# EAGLE design m220pal (EAGLE 4.11)
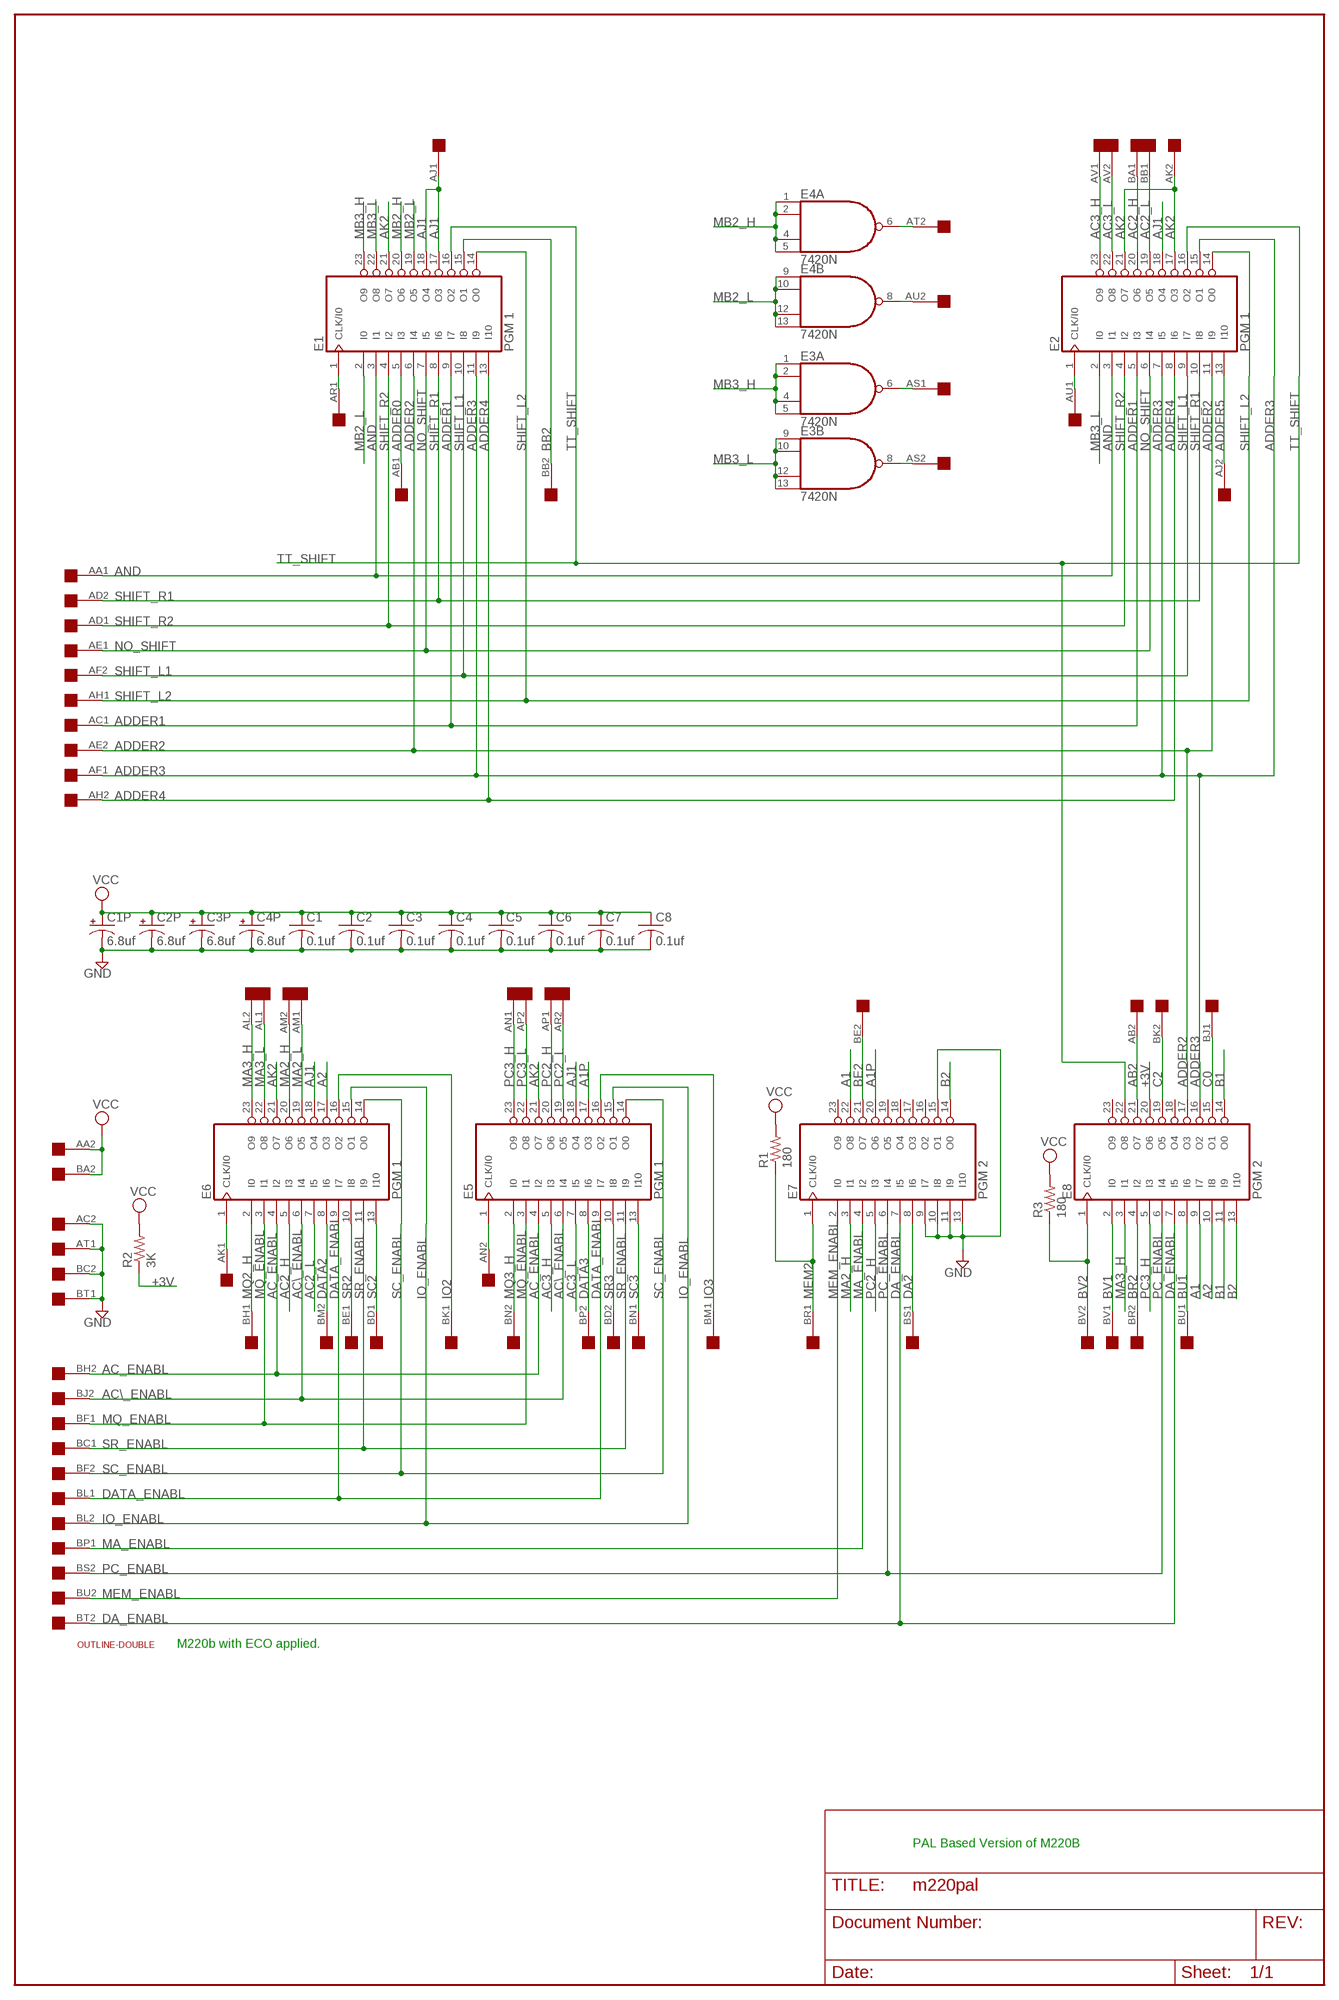
[diagram p0: schematic, sheet 1]

## Parts
C1  0.1uf  C-US050-025X075  [C050-025X075]
C1P  6.8uf  CPOL-USE15-5AXIAL  [E15-5]
C2  0.1uf  C-US050-025X075  [C050-025X075]
C2P  6.8uf  CPOL-USE15-5AXIAL  [E15-5]
C3  0.1uf  C-US050-025X075  [C050-025X075]
C3P  6.8uf  CPOL-USE15-5AXIAL  [E15-5]
C4  0.1uf  C-US050-025X075  [C050-025X075]
C4P  6.8uf  CPOL-USE15-5AXIAL  [E15-5]
C5  0.1uf  C-US050-025X075  [C050-025X075]
C6  0.1uf  C-US050-025X075  [C050-025X075]
C7  0.1uf  C-US050-025X075  [C050-025X075]
C8  0.1uf  C-US050-025X075  [C050-025X075]
E1  PGM 1  22V10  [DIL24-3]
E2  PGM 1  22V10  [DIL24-3]
E3  7420N  74S20N  [DIL14]
E4  7420N  74S20N  [DIL14]
E5  PGM 1  22V10  [DIL24-3]
E6  PGM 1  22V10  [DIL24-3]
E7  PGM 2  22V10  [DIL24-3]
E8  PGM 2  22V10  [DIL24-3]
R1  180  R-US_0207/10  [0207/10]
R2  3K  R-US_0207/10  [0207/10]
R3  180  R-US_0207/10  [0207/10]
U$1  DOUBLE  [EDGE-CON4]
U$2  OUTLINE-DOUBLE  [DOUBLE]

## Nets
+3V: E8.20(O6) R2.1
A1: E7.22(O8) E8.9(I7)
A1P: E5.17(O3) E7.20(O6)
A2: E6.17(O3) E8.10(I8)
AB2: E8.21(O7) U$1.AB2
AC2_H: E2.20(O6) E6.5(I3) U$1.BA1
AC2_L: E2.19(O5) E6.7(I5) U$1.BB1
AC3_H: E2.23(O9) E5.5(I3) U$1.AV1
AC3_L: E2.22(O8) E5.7(I5) U$1.AV2
AC\_ENABL: E5.6(I4) E6.6(I4) U$1.BJ2
AC_ENABL: E5.4(I2) E6.4(I2) U$1.BH2
ADDER0: E1.5(I3) U$1.AB1
ADDER1: E1.9(I7) E2.5(I3) U$1.AC1
ADDER2: E1.6(I4) E2.11(I9) E8.17(O3) U$1.AE2
ADDER3: E1.11(I9) E2.7(I5) E2.15(O1) E8.16(O2) U$1.AF1
ADDER4: E1.13(I10) E2.8(I6) U$1.AH2
ADDER5: E2.13(I10) U$1.AJ2
AJ1: E1.17(O3) E1.18(O4) E2.18(O4) E5.18(O4) E6.18(O4) U$1.AJ1
AK2: E1.21(O7) E2.17(O3) E2.21(O7) E5.21(O7) E6.21(O7) U$1.AK2
AND: E1.3(I1) E2.3(I1) U$1.AA1
AS1: E3.6(A:O) U$1.AS1
AS2: E3.8(B:O) U$1.AS2
AT2: E4.6(A:O) U$1.AT2
AU2: E4.8(B:O) U$1.AU2
B1: E8.11(I9) E8.14(O0)
B2: E7.14(O0) E8.13(I10)
BB2: E1.15(O1) U$1.BB2
BE2: E7.21(O7) U$1.BE2
BR2: E8.4(I2) U$1.BR2
BU1: E8.8(I6) U$1.BU1
BV1: E8.2(I0) U$1.BV1
BV2: E8.1(CLK/I0) R3.1 U$1.BV2
C0: E8.15(O1) U$1.BJ1
C2: E8.19(O5) U$1.BK2
DA2: E7.8(I6) U$1.BS1
DA_ENABL: E7.7(I5) E8.7(I5) U$1.BT2
DATA2: E6.8(I6) U$1.BM2
DATA3: E5.8(I6) U$1.BP2
DATA_ENABL: E5.9(I7) E6.9(I7) U$1.BL1
GND: C1.2 C1P.- C2.2 C2P.- C3.2 C3P.- C4.2 C4P.- C5.2 C6.2 C7.2 C8.2 E7.9(I7) E7.10(I8) E7.11(I9) E7.13(I10) E7.15(O1) U$1.AC2 U$1.AT1 U$1.BC2 U$1.BT1
IO2: E6.16(O2) U$1.BK1
IO3: E5.16(O2) U$1.BM1
IO_ENABL: E5.15(O1) E6.15(O1) U$1.BL2
MA2_H: E6.20(O6) E7.3(I1) U$1.AM2
MA2_L: E6.19(O5) U$1.AM1
MA3_H: E6.23(O9) E8.3(I1) U$1.AL2
MA3_L: E6.22(O8) U$1.AL1
MA_ENABL: E7.4(I2) U$1.BP1
MB2_H: E1.20(O6) E4.1(A:I0) E4.2(A:I1) E4.4(A:I2) E4.5(A:I3)
MB2_L: E1.2(I0) E1.19(O5) E4.9(B:I0) E4.10(B:I1) E4.12(B:I2) E4.13(B:I3)
MB3_H: E1.23(O9) E3.1(A:I0) E3.2(A:I1) E3.4(A:I2) E3.5(A:I3)
MB3_L: E1.22(O8) E2.2(I0) E3.9(B:I0) E3.10(B:I1) E3.12(B:I2) E3.13(B:I3)
MEM2: E7.1(CLK/I0) R1.1 U$1.BR1
MEM_ENABL: E7.2(I0) U$1.BU2
MQ2_H: E6.2(I0) U$1.BH1
MQ3_H: E5.2(I0) U$1.BN2
MQ_ENABL: E5.3(I1) E6.3(I1) U$1.BF1
N$1: E6.1(CLK/I0) U$1.AK1
N$2: E5.1(CLK/I0) U$1.AN2
N$3: E1.1(CLK/I0) U$1.AR1
N$4: E2.1(CLK/I0) U$1.AU1
NO_SHIFT: E1.7(I5) E2.6(I4) U$1.AE1
PC2_H: E5.20(O6) E7.5(I3) U$1.AP1
PC2_L: E5.19(O5) U$1.AR2
PC3_H: E5.23(O9) E8.5(I3) U$1.AN1
PC3_L: E5.22(O8) U$1.AP2
PC_ENABL: E7.6(I4) E8.6(I4) U$1.BS2
SC2: E6.13(I10) U$1.BD1
SC3: E5.13(I10) U$1.BN1
SC_ENABL: E5.14(O0) E6.14(O0) U$1.BF2
SHIFT_L1: E1.10(I8) E2.9(I7) U$1.AF2
SHIFT_L2: E1.14(O0) E2.14(O0) U$1.AH1
SHIFT_R1: E1.8(I6) E2.10(I8) U$1.AD2
SHIFT_R2: E1.4(I2) E2.4(I2) U$1.AD1
SR2: E6.10(I8) U$1.BE1
SR3: E5.10(I8) U$1.BD2
SR_ENABL: E5.11(I9) E6.11(I9) U$1.BC1
TT_SHIFT: E1.16(O2) E2.16(O2) E8.22(O8)
VCC: C1.1 C1P.+ C2.1 C2P.+ C3.1 C3P.+ C4.1 C4P.+ C5.1 C6.1 C7.1 C8.1 R1.2 R2.2 R3.2 U$1.AA2 U$1.BA2
Unconnected: E7.16(O2) E7.17(O3) E7.18(O4) E7.19(O5) E7.23(O9) E8.18(O4) E8.23(O9)

## Notes on the sheet
- M220b with ECO applied.
- PAL Based Version of M220B

## Power pins joined to a net without a drawn wire
GND: E1.12(GND) E2.12(GND) E3.7(P:GND) E4.7(P:GND) E5.12(GND) E6.12(GND) E7.12(GND) E8.12(GND)
VCC: E1.24(VCC) E2.24(VCC) E3.14(P:VCC) E4.14(P:VCC) E5.24(VCC) E6.24(VCC) E7.24(VCC) E8.24(VCC)

## Library data of the parts
C1-C8 = rcl:C-US: CAPACITOR, American symbol
C1P C2P C3P C4P = rcl:CPOL-US: POLARIZED CAPACITOR, American symbol
E1 E2 E5-E8 = pal:22V10: PAL
E3 E4 = 74xx-jameco:74*20: Dual 4-input NAND gate
R1-R3 = rcl:R-US_: RESISTOR, American symbol
U$1 = dec-con:DOUBLE: Double-Height DEC board
U$2 = dec-con:OUTLINE-*: Board outlines for DEC boards.

## Board
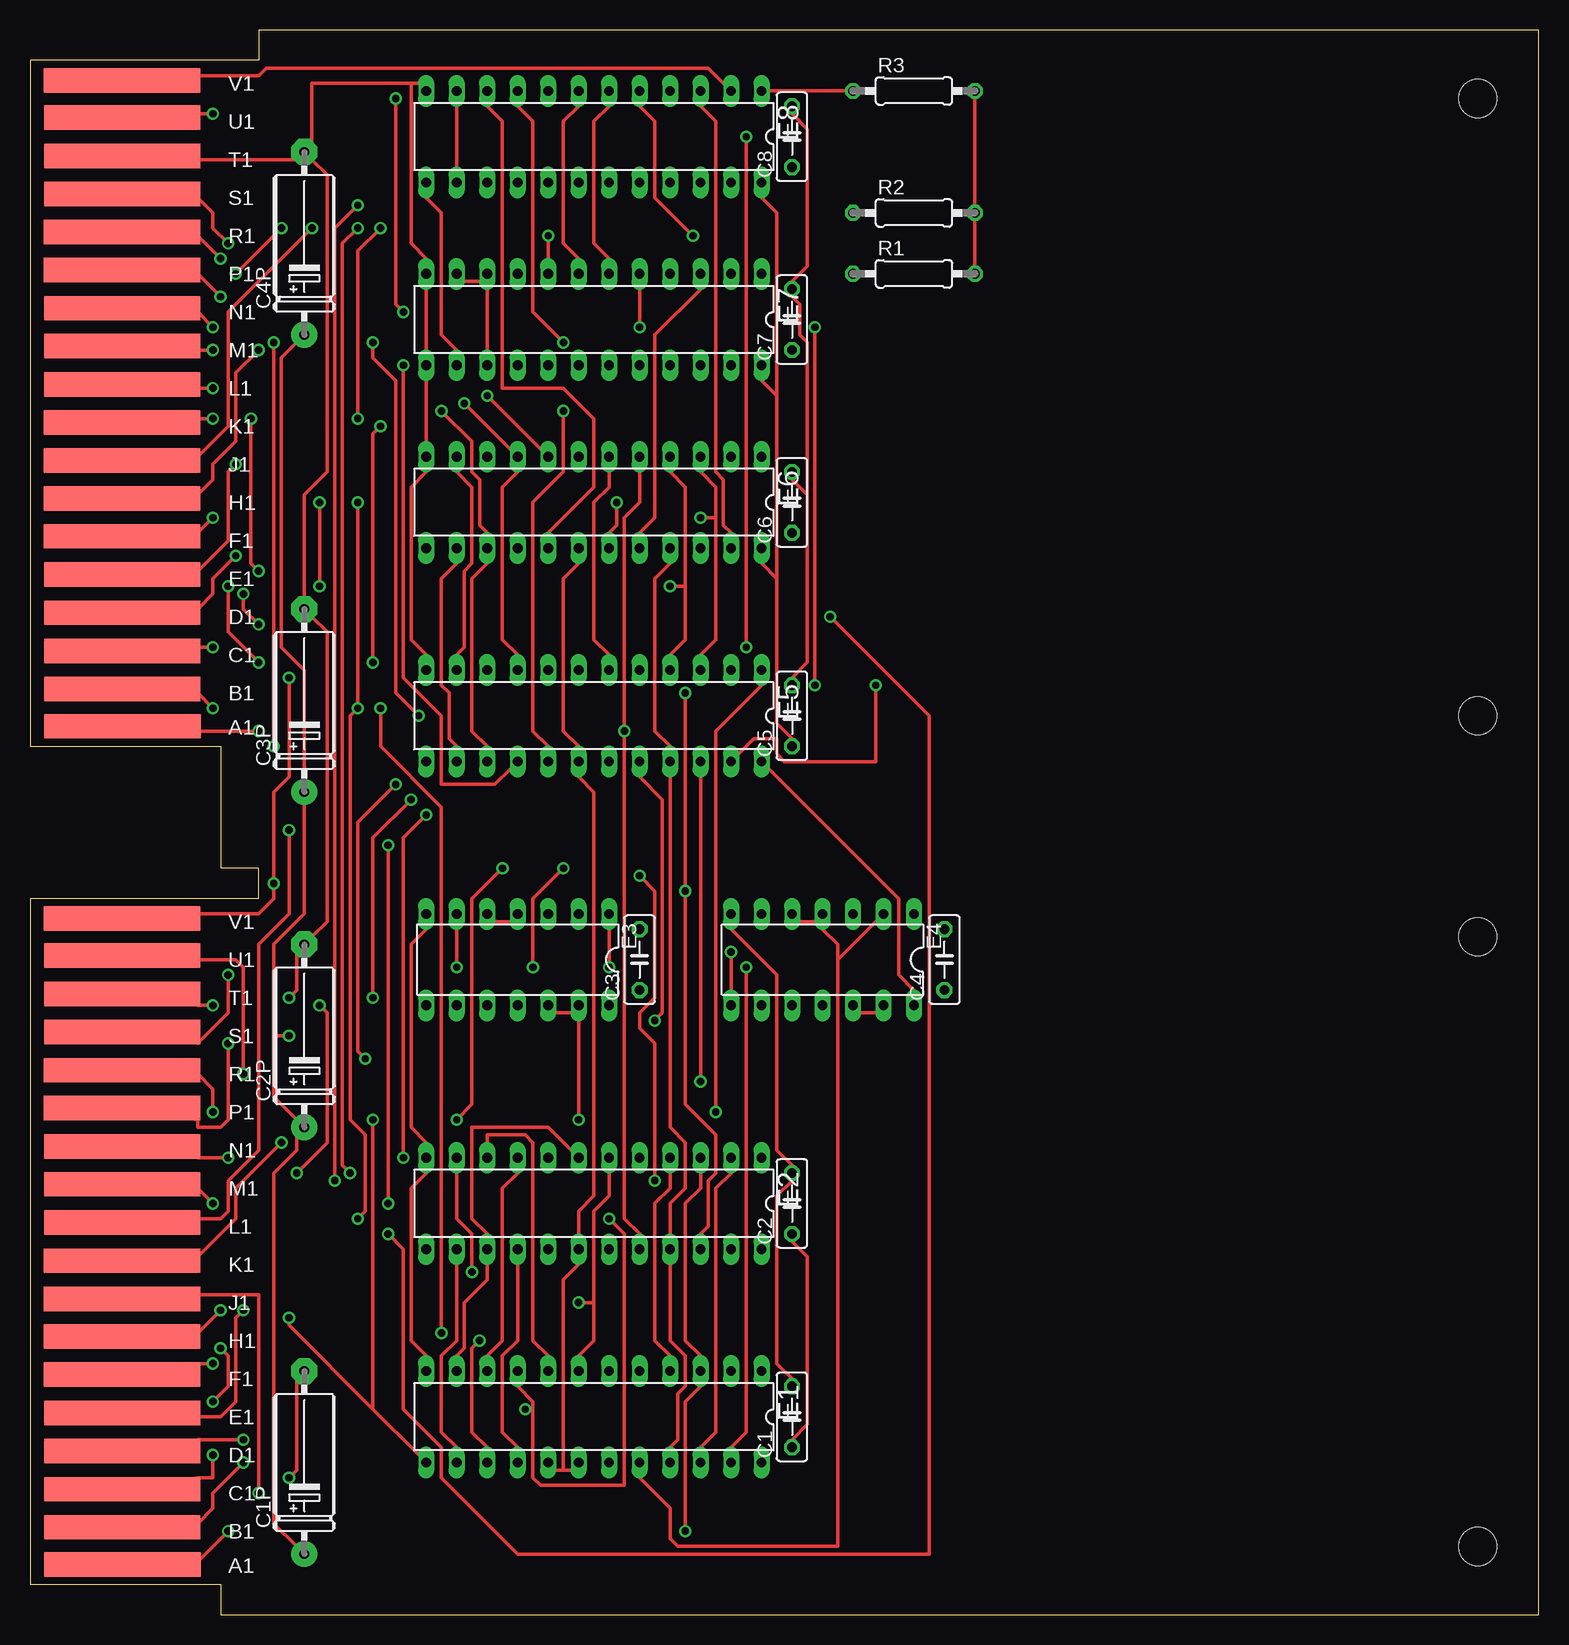
[diagram p1: board, top side]
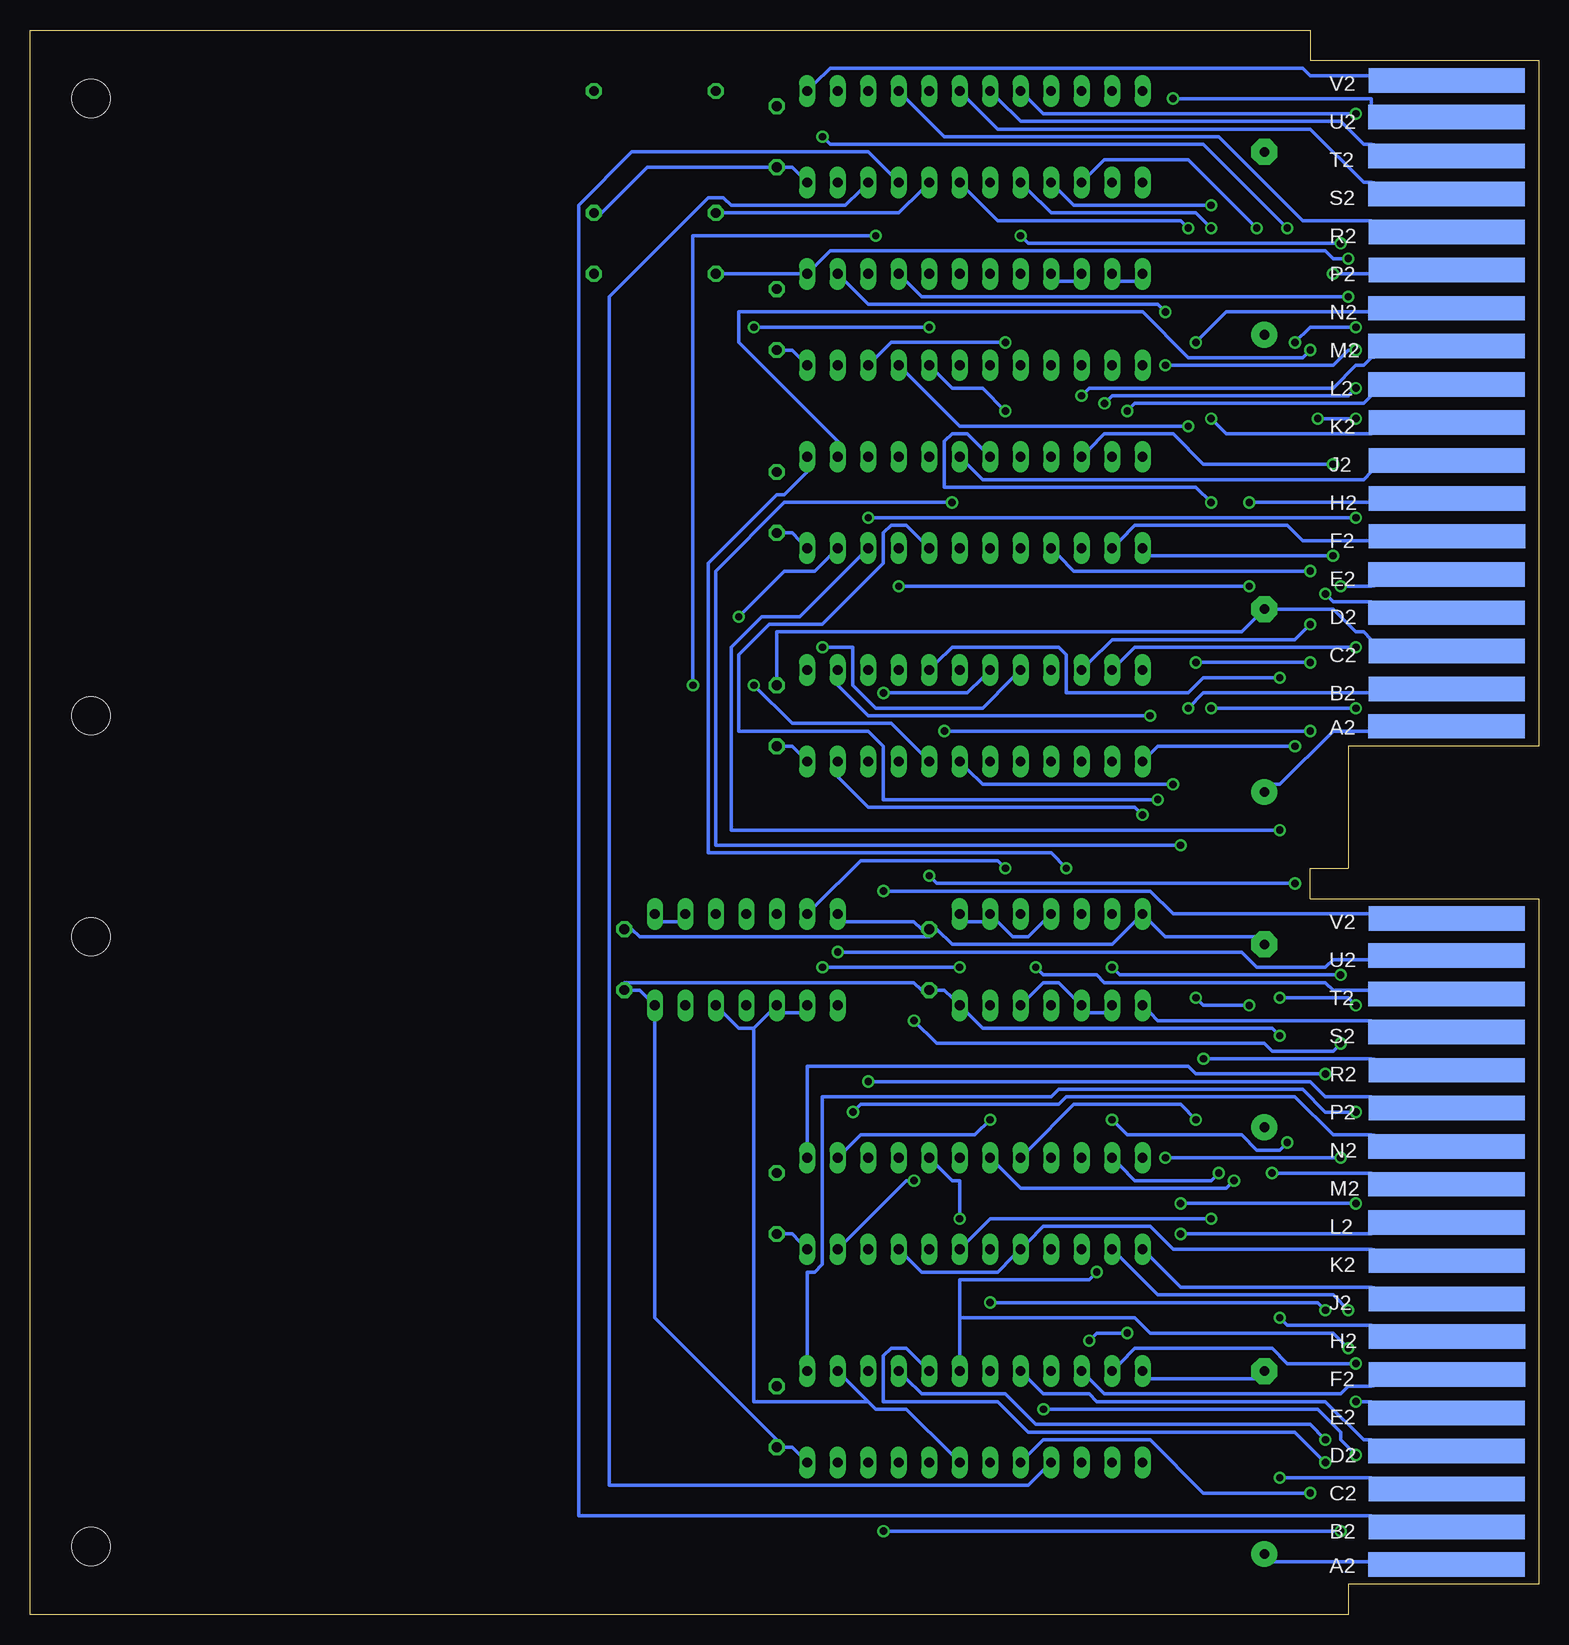
[diagram p2: board, bottom side, seen from below]

Size 125.73 x 132.08 mm. Coordinates in mm from the lower left corner, seen from the top.
Copper layers (1*16): Top 0.035mm / dielectric 1.5mm / Bottom 0.035mm
Design rules "olimex10mil": minimum track width 12mil, minimum drill 24mil, track to track 12mil, track to pad 12mil, pad to pad 12mil, via to via 12mil, smd to smd 10mil, copper to edge 25mil, drill to drill 10mil, minimum pad ring 10mil, minimum via ring 8mil, stop-mask expansion 0mil, vias tented up to drill 0mil, thermal gap 10mil

### Footprints (pad centres in the part's own frame; a part is rotated, then mirrored left to right if it is on the bottom)
C050-025X075 = drill 0.813 octagon: 1 -2.54,0; 2 2.54,0
E15-5 = drill 0.813 pad 2.159 round: + -7.62,0 | drill 0.813 pad 2.159 octagon: - 7.62,0
DIL24-3 = drill 0.813 long: 1 -13.97,-3.81; 2 -11.43,-3.81; 3 -8.89,-3.81; 4 -6.35,-3.81; 5 -3.81,-3.81; 6 -1.27,-3.81; 7 1.27,-3.81; 8 3.81,-3.81; 9 6.35,-3.81; 10 8.89,-3.81; 11 11.43,-3.81; 12 13.97,-3.81; 13 13.97,3.81; 14 11.43,3.81; 15 8.89,3.81; 16 6.35,3.81; 17 3.81,3.81; 18 1.27,3.81; 19 -1.27,3.81; 20 -3.81,3.81; 21 -6.35,3.81; 22 -8.89,3.81; 23 -11.43,3.81; 24 -13.97,3.81
DIL14 = drill 0.813 long: 1 -7.62,-3.81; 2 -5.08,-3.81; 3 -2.54,-3.81; 4 0,-3.81; 5 2.54,-3.81; 6 5.08,-3.81; 7 7.62,-3.81; 8 7.62,3.81; 9 5.08,3.81; 10 2.54,3.81; 11 0,3.81; 12 -2.54,3.81; 13 -5.08,3.81; 14 -7.62,3.81
0207/10 = drill 0.813 octagon: 1 -5.08,0; 2 5.08,0
EDGE-CON4 = smd 13.017 x 2.032: AA1 7.709,4.207; AB1 7.684,7.312; AC1 7.684,10.474; AD1 7.684,13.665; AE1 7.693,16.84; AF1 7.668,20.041; AH1 7.668,23.19; AJ1 7.668,26.34; AK1 7.668,29.515; AL1 7.693,32.69; AM1 7.693,35.89; AN1 7.693,39.04; AP1 7.668,42.24; AR1 7.668,45.39; AS1 7.693,48.565; AT1 7.693,51.74; AU1 7.693,54.94; AV1 7.668,58.026; BA1 7.709,74.057; BB1 7.684,77.162; BC1 7.684,80.324; BD1 7.684,83.515; BE1 7.693,86.69; BF1 7.668,89.891; BH1 7.668,93.04; BJ1 7.668,96.19; BK1 7.668,99.365; BL1 7.693,102.54; BM1 7.693,105.74; BN1 7.693,108.89; BP1 7.668,112.09; BR1 7.668,115.24; BS1 7.693,118.415; BT1 7.693,121.59; BU1 7.693,124.79; BV1 7.668,127.876 | smd 13.017 x 2.032 bottom: AA2 7.69,4.207; AB2 7.668,7.328; AC2 7.668,10.49; AD2 7.693,13.665; AE2 7.693,16.84; AF2 7.642,20.041; AH2 7.642,23.19; AJ2 7.668,26.34; AK2 7.668,29.515; AL2 7.693,32.69; AM2 7.693,35.89; AN2 7.693,39.04; AP2 7.668,42.24; AR2 7.668,45.39; AS2 7.693,48.565; AT2 7.693,51.74; AU2 7.693,54.966; AV2 7.668,58.026; BA2 7.69,74.057; BB2 7.668,77.178; BC2 7.668,80.34; BD2 7.693,83.515; BE2 7.693,86.69; BF2 7.642,89.891; BH2 7.642,93.04; BJ2 7.668,96.19; BK2 7.668,99.365; BL2 7.693,102.54; BM2 7.693,105.74; BN2 7.693,108.89; BP2 7.668,112.09; BR2 7.668,115.24; BS2 7.693,118.415; BT2 7.693,121.59; BU2 7.693,124.816; BV2 7.668,127.876
DOUBLE = hole 3.175: 120.65,56.515; 120.65,5.715; 120.65,74.93; 120.65,126.365

### Placement (x,y rotation side)
C1  63.5,16.51 90 top
C1P  22.86,12.7 90 top
C2  63.5,34.29 90 top
C2P  22.86,48.26 90 top
C3  50.8,54.61 90 top
C3P  22.86,76.2 90 top
C4  76.2,54.61 90 top
C4P  22.86,114.3 90 top
C5  63.5,74.93 90 top
C6  63.5,92.71 90 top
C7  63.5,107.95 90 top
C8  63.5,123.19 90 top
E1  46.99,16.51 180 top
E2  46.99,34.29 180 top
E3  40.64,54.61 180 top
E4  66.04,54.61 180 top
E5  46.99,74.93 180 top
E6  46.99,92.71 180 top
E7  46.99,107.95 180 top
E8  46.99,123.19 180 top
R1  73.66,111.76 0 top
R2  73.66,116.84 0 top
R3  73.66,127 0 top
U$1  0,0 0 top
U$2  0,0 0 top

### Tracks (layer width: path | path; a pad name or v marks a point on that pad's centre or on a via)
+3V
  Bottom 0.305: E8.20 51.44,118.75 53.34,116.84 67.95,116.84 R2.1
A1  (via drill 0.61)
  Top 0.305: v44.45,106.05 41.91,108.58 41.91,124.46 40.64,125.73 E8.9
  Bottom 0.305: v44.45,106.05 53.98,106.05 55.25,104.78 E7.22
A1P  (via drill 0.61)
  Top 0.305: v44.45,100.33 44.45,95.25 41.91,92.71 41.91,73.66 43.18,72.39 E5.17
  Bottom 0.305: v44.45,100.33 46.36,102.23 48.9,102.23 50.17,103.5 E7.20
A2
  Top 0.305: E6.17 43.18,90.17 46.99,93.98 46.99,99.69 44.45,102.23 39.37,102.23 39.37,124.46 38.1,125.73 E8.10
AB2
  Bottom 0.305: E8.21 53.98,120.02 55.88,121.92 75.57,121.92 80.01,117.47 80.01,8.26 13.97,8.26 U$1.AB2
AC2_H  (via drill 0.61)
  Top 0.305: E2.20 50.8,31.75 49.53,33.02 v49.53,73.66 49.53,91.44 50.8,92.71 50.8,95.25 E6.5 | v19.05,73.66 13.97,73.66 U$1.BA1
  Bottom 0.305: v49.53,73.66 v19.05,73.66
AC2_L  (via drill 0.61)
  Top 0.305: v27.31,92.71 v27.31,75.56 26.67,74.93 26.67,41.27 27.94,40.01 27.94,33.66 v27.31,33.02 | v15.24,75.56 13.97,76.83 U$1.BB1
  Bottom 0.305: v27.31,92.71 28.58,93.98 49.53,93.98 49.53,97.79 48.9,98.42 47.63,98.42 46.36,97.16 E6.7 | v27.31,75.56 v15.24,75.56 | v27.31,33.02 45.72,33.02 47.63,31.11 E2.19
AC3_H  (via drill 0.61)
  Top 0.305: v21.59,78.11 21.59,69.85 20.32,68.58 v20.32,60.96 20.32,59.69 19.05,58.42 13.97,58.42 U$1.AV1 | v52.07,36.2 52.07,47.62 50.8,48.9 50.8,50.16 52.07,51.44 52.07,60.33 v50.8,61.59
  Bottom 0.305: v21.59,78.11 27.94,78.11 29.21,76.83 39.37,76.83 39.37,80.01 40.01,80.64 48.9,80.64 50.17,79.38 E5.5 | v52.07,36.2 52.71,36.2 57.79,31.11 E2.23 | v50.8,61.59 50.17,60.96 v20.32,60.96
AC3_L  (via drill 0.61)
  Top 0.305: v54.61,76.83 v54.61,60.33 54.61,42.55 57.15,40.01 57.15,36.83 56.52,36.2 56.52,32.38 55.88,31.75 E2.22
  Bottom 0.305: v54.61,76.83 47.63,76.83 46.36,78.11 E5.7 | v54.61,60.33 32.39,60.33 30.48,58.42 13.97,58.42 U$1.AV2
AC\_ENABL
  Top 0.305: E5.6 48.26,80.01 46.99,81.28 46.99,92.71 48.26,93.98 48.26,95.25 E6.6
  Bottom 0.305: E6.6 47.63,95.89 46.36,94.61 14.61,94.61 13.97,95.25 U$1.BJ2
AC_ENABL  (via drill 0.61)
  Top 0.305: 54.61,85.72 54.61,93.98 53.34,95.25 E6.4 | 54.61,85.72 54.61,81.28 53.34,80.01 E5.4 | v53.34,85.72 54.61,85.72 | v24.13,92.71 v24.13,85.72
  Bottom 0.305: v24.13,85.72 v53.34,85.72 | v24.13,92.71 13.97,92.71 U$1.BH2
ADDER0  (via drill 0.61)
  Top 0.305: v17.78,12.7 15.24,10.16 15.24,8.89 13.97,7.62 U$1.AB1
  Bottom 0.305: v17.78,12.7 20.32,15.24 42.55,15.24 45.09,17.78 54.61,17.78 54.61,21.59 53.98,22.23 52.71,22.23 51.44,20.95 E1.5
ADDER1  (via drill 0.61)
  Top 0.305: 41.91,17.14 41.91,11.43 42.55,10.79 49.53,10.79 49.53,31.75 v48.26,33.02 | 41.91,17.14 41.91,17.78 40.64,19.05 E1.9 | v15.24,13.34 15.24,11.43 13.97,11.43 U$1.AC1 | v41.28,17.14 41.91,17.14
  Bottom 0.305: v48.26,33.02 48.26,36.2 48.9,36.2 50.17,37.47 E2.5 | v15.24,13.34 16.51,14.61 16.51,15.24 18.42,17.14 v41.28,17.14
ADDER2  (via drill 0.61)
  Top 0.305: v36.83,28.57 36.83,31.75 35.56,33.02 35.56,36.83 E2.11 | v27.31,115.57 26.04,114.3 26.04,37.47 v26.67,36.83 | v15.24,17.78 16.51,19.05 16.51,21.59 v15.88,22.23
  Bottom 0.305: 48.26,24.77 48.26,27.94 37.47,27.94 v36.83,28.57 | 48.26,24.77 48.26,21.59 E1.6 | v27.31,115.57 28.58,116.84 40.64,116.84 42.55,118.75 E8.17 | v26.67,36.83 27.31,36.2 33.66,36.2 34.93,37.47 E2.11 | v15.24,17.78 13.97,17.78 U$1.AE2 | v15.88,22.23 17.15,23.5 32.39,23.5 33.66,24.77 48.26,24.77
ADDER3  (via drill 0.61)
  Top 0.305: E1.11 35.56,21.59 36.2,22.23 36.2,26.04 38.1,27.94 38.1,29.21 E2.15 38.1,31.75 36.83,33.02 36.83,40.64 43.18,40.64 45.09,38.73 E2.7 | v27.31,117.47 25.4,115.57 v25.4,36.2 | v15.24,20.95 13.97,20.95 U$1.AF1
  Bottom 0.305: v27.31,117.47 38.74,117.47 40.01,118.75 E8.16 | v25.4,36.2 26.04,35.56 43.18,35.56 45.09,37.47 E2.7 | v15.24,20.95 20.96,20.95 22.23,22.23 33.66,22.23 34.93,20.95 E1.11
ADDER4  (via drill 0.61)
  Top 0.305: 28.58,17.14 21.59,24.13 v21.59,24.77 | 28.58,17.14 32.39,13.34 E1.13 | 28.58,17.14 v28.58,41.27
  Bottom 0.305: v21.59,24.77 20.96,24.13 13.97,24.13 U$1.AH2 | v28.58,41.27 29.85,42.55 38.74,42.55 42.55,38.73 E2.8
ADDER5
  Bottom 0.305: E2.13 32.39,29.84 29.85,27.3 13.97,27.3 U$1.AJ2
AJ1  (via drill 0.61)
  Top 0.305: E6.18 45.72,87.63 44.45,86.36 44.45,73.66 45.72,72.39 E5.18 45.72,69.85 46.99,68.58 46.99,34.92 45.72,33.66 45.72,31.75 E2.18 45.72,29.21 44.45,27.94 44.45,12.06 | 44.45,12.06 45.09,12.06 E1.18 | 44.45,12.06 43.82,12.06 E1.17 | v19.05,10.16 19.05,26.67 13.97,26.67 U$1.AJ1
  Bottom 0.305: v19.05,10.16 27.94,10.16 32.39,14.61 41.28,14.61 42.55,13.34 E1.17
AK2
  Top 0.305: E6.21 53.34,87.63 52.07,86.36 52.07,73.66 53.34,72.39 E5.21 53.34,69.85 53.34,40.64 54.61,39.37 54.61,35.56 53.34,34.29 53.34,31.75 E2.21 53.34,29.21 53.34,22.86 54.61,21.59 54.61,19.05 53.98,18.41 53.98,14.61 53.34,13.97 E1.21
  Bottom 0.305: E2.21 52.71,29.84 51.44,28.57 45.09,28.57 43.82,29.84 E2.17 42.55,31.11 41.28,32.38 32.39,32.38 30.48,30.48 13.97,30.48 U$1.AK2
AND  (via drill 0.61)
  Top 0.305: E2.3 55.88,36.83 55.88,35.56 54.61,34.29 54.61,22.86 55.88,21.59 E1.3 55.88,19.05 54.61,17.78 v54.61,6.99 | v16.51,6.99 13.97,4.45 U$1.AA1
  Bottom 0.305: v16.51,6.99 v54.61,6.99
AS1  (via drill 0.61)
  Top 0.305: v35.56,53.98 35.56,57.15 E3.6 | v16.51,53.34 16.51,50.16 13.97,47.62 U$1.AS1
  Bottom 0.305: v35.56,53.98 34.93,53.34 v16.51,53.34
AS2
  Bottom 0.305: E3.8 32.39,50.16 31.75,49.53 13.97,49.53 U$1.AS2
AT2  (via drill 0.61)
  Top 0.305: v44.45,62.23 41.91,59.69 v41.91,53.98
  Bottom 0.305: v44.45,62.23 45.09,62.87 56.52,62.87 60.33,59.05 E4.6 | v41.91,53.98 41.28,53.34 36.83,53.34 36.2,52.7 17.78,52.7 17.15,52.07 13.97,52.07 U$1.AT2
AU2  (via drill 0.61)
  Top 0.305: v58.42,55.24 58.42,52.07 E4.8
  Bottom 0.305: v58.42,55.24 24.77,55.24 23.5,53.98 17.78,53.98 17.15,54.61 13.97,54.61 U$1.AU2
B1
  Top 0.305: E8.14 35.56,120.65 35.56,125.73 E8.11
B2
  Top 0.305: E7.14 35.56,105.41 34.29,106.68 34.29,116.84 33.02,118.11 E8.13
BB2  (via drill 0.61)
  Top 0.305: v37.47,22.86 36.83,22.23 36.83,15.24 38.1,13.97 E1.15 | v34.29,23.5 34.29,67.31 29.21,72.39 v29.21,75.56
  Bottom 0.305: v37.47,22.86 36.83,23.5 v34.29,23.5 | v29.21,75.56 27.94,76.83 13.97,76.83 U$1.BB2
BE2  (via drill 0.61)
  Top 0.305: v29.21,99.06 28.58,98.42 v28.58,79.38 | v19.05,79.38 16.51,81.92 v16.51,85.72
  Bottom 0.305: v29.21,99.06 48.26,99.06 52.71,103.5 E7.21 | v19.05,79.38 v28.58,79.38 | v16.51,85.72 13.97,85.72 U$1.BE2
BR2
  Bottom 0.305: E8.4 52.71,126.36 49.53,123.19 26.67,123.19 19.69,116.2 13.97,116.2 U$1.BR2
BU1  (via drill 0.61)
  Top 0.305: v15.24,125.09 13.97,125.09 U$1.BU1
  Bottom 0.305: v15.24,125.09 41.28,125.09 42.55,126.36 E8.8
BV1
  Top 0.305: E8.2 57.79,127.64 56.52,128.91 19.69,128.91 19.05,128.27 13.97,128.27 U$1.BV1
BV2
  Top 0.305: E8.1 61.6,127 67.95,127 R3.1
  Bottom 0.305: E8.1 60.33,127.64 59.06,128.91 19.69,128.91 19.05,128.27 13.97,128.27 U$1.BV2
C0  (via drill 0.61)
  Top 0.305: v23.5,115.57 16.51,108.58 16.51,99.06 13.97,96.52 U$1.BJ1
  Bottom 0.305: v23.5,115.57 29.21,121.28 36.2,121.28 37.47,120.02 E8.15
C2  (via drill 0.61)
  Top 0.305: v29.21,115.57 27.31,113.67 v27.31,99.69
  Bottom 0.305: v29.21,115.57 29.85,116.2 45.09,116.2 47.63,118.75 E8.19 | v27.31,99.69 26.04,98.42 13.97,98.42 U$1.BK2
DA2  (via drill 0.61)
  Top 0.305: v43.18,114.94 43.18,113.03 E7.8 | v16.51,114.3 15.24,115.57 15.24,116.84 13.97,118.11 U$1.BS1
  Bottom 0.305: v43.18,114.94 42.55,114.3 v16.51,114.3
DA_ENABL
  Top 0.305: E7.7 45.72,113.03 44.45,114.3 44.45,124.46 45.72,125.73 E8.7
  Bottom 0.305: E8.7 45.09,126.36 43.18,124.46 16.51,124.46 14.61,122.56 13.97,122.56 U$1.BT2
DATA2  (via drill 0.61)
  Top 0.305: v38.1,101.6 42.55,97.16 E6.8
  Bottom 0.305: v38.1,101.6 37.47,102.23 17.15,102.23 15.24,104.14 14.61,104.14 13.97,104.78 U$1.BM2
DATA3  (via drill 0.61)
  Top 0.305: v59.69,123.19 v59.69,80.64 | v17.15,111.76 v20.96,115.57
  Bottom 0.305: v59.69,80.64 57.15,80.64 57.15,77.47 55.25,75.56 46.36,75.56 43.82,78.11 E5.8 | v59.69,123.19 59.06,122.56 27.94,122.56 v20.96,115.57 | v17.15,111.76 13.97,111.76 U$1.BP2
DATA_ENABL  (via drill 0.61)
  Top 0.305: E5.9 40.64,80.01 39.37,81.28 39.37,93.98 40.64,95.25 E6.9 40.01,97.16 v36.2,100.97 | v15.24,102.23 13.97,102.23 U$1.BL1
  Bottom 0.305: v36.2,100.97 35.56,101.6 15.88,101.6 v15.24,102.23
GND  (via drill 0.61)
  Top 0.305: E7.15 38.1,105.41 38.1,110.49 E7.10 37.47,111.12 36.2,111.12 E7.11 | E5.12 33.02,80.01 31.75,81.28 31.75,93.98 33.02,95.25 E6.12 33.02,97.79 33.02,102.87 E7.13 33.02,105.41 33.02,110.49 E7.12 33.02,113.03 31.75,114.3 31.75,127.64 | 31.75,127.64 23.5,127.64 23.5,122.56 C4P.- | 31.75,127.64 32.39,127.64 E8.12 | C4P.- 22.23,121.28 13.97,121.28 U$1.BT1 | C8.2 63.5,125.09 64.77,123.83 64.77,112.39 63.5,111.12 C7.2 63.5,109.86 64.14,109.22 64.14,106.68 64.77,106.05 64.77,93.34 | 64.77,93.34 64.77,79.38 63.5,78.11 C5.2 | 64.77,93.34 63.5,94.61 C6.2 | E1.12 33.02,21.59 31.75,22.86 31.75,35.56 33.02,36.83 E2.12 33.02,39.37 31.75,40.64 31.75,55.88 33.02,57.15 E3.7 | C1.2 63.5,19.68 62.23,20.95 62.23,34.92 63.5,36.2 C2.2 63.5,37.47 62.23,38.73 62.23,53.34 58.42,57.15 E4.7 | v21.59,11.43 22.23,12.06 22.23,19.68 C1P.- | v15.24,50.8 13.97,50.8 U$1.AT1 | v21.59,51.44 22.23,52.07 22.23,55.24 C2P.- 23.5,56.52 24.77,57.78 24.77,81.92 23.5,83.19 C3P.- 22.86,84.45 22.86,93.34 24.77,95.25 24.77,120.02 23.5,121.28 C4P.-
  Bottom 0.305: E7.12 33.66,111.12 34.93,111.12 E7.11 | E7.9 40.01,111.12 38.74,111.12 E7.10 | U$1.BC2 13.97,81.28 14.61,81.92 15.24,81.92 17.15,83.82 22.23,83.82 C3P.- 23.5,83.19 24.77,81.92 63.5,81.92 63.5,78.11 C5.2 | E1.12 32.39,19.68 23.5,19.68 C1P.- | C2P.- 23.5,56.52 31.12,56.52 32.39,57.78 E3.7 33.66,57.78 35.56,55.88 48.9,55.88 50.17,57.15 C3.2 | C3.2 51.44,57.15 52.07,57.78 57.79,57.78 E4.7 | C4.2 75.57,57.15 74.93,56.52 50.8,56.52 C3.2 | v21.59,11.43 13.97,11.43 U$1.AC2 | v15.24,50.8 15.88,51.44 v21.59,51.44
IO2  (via drill 0.61)
  Top 0.305: v19.05,87 18.42,87.63 v18.42,99.69 | v15.24,99.69 13.97,99.69 U$1.BK1
  Bottom 0.305: v19.05,87 38.74,87 40.01,88.27 E6.16 | v18.42,99.69 v15.24,99.69
IO3  (via drill 0.61)
  Top 0.305: v31.12,104.14 31.12,78.11 34.29,74.93 34.29,69.22 38.74,69.22 40.01,70.48 E5.16 | v15.24,105.41 13.97,105.41 U$1.BM1
  Bottom 0.305: v31.12,104.14 17.15,104.14 15.88,105.41 v15.24,105.41
IO_ENABL  (via drill 0.61)
  Top 0.305: E5.15 38.1,72.39 36.83,73.66 36.83,86.36 38.1,87.63 E6.15 38.1,90.17 37.47,90.81 37.47,94.61 36.83,95.25 36.83,97.79 v34.29,100.33
  Bottom 0.305: v34.29,100.33 33.66,100.97 14.61,100.97 13.97,101.6 U$1.BL2
MA2_H  (via drill 0.61)
  Top 0.305: E6.20 50.8,90.17 52.07,91.44 52.07,106.68 55.88,110.49 E7.3 | v31.75,67.94 28.58,64.77 v28.58,51.44 | v24.13,50.8 24.77,50.16 24.77,39.37 v22.23,36.83
  Bottom 0.305: v31.75,67.94 54.61,67.94 54.61,72.39 55.88,73.66 66.68,73.66 66.68,80.01 64.14,82.55 59.69,82.55 54.61,87.63 54.61,90.17 53.98,90.81 52.71,90.81 51.44,89.53 E6.20 | v28.58,51.44 27.94,50.8 v24.13,50.8 | v22.23,36.83 13.97,36.83 U$1.AM2
MA2_L  (via drill 0.61)
  Top 0.305: v48.9,92.71 48.9,90.81 48.26,90.17 E6.19 | v29.85,34.29 v29.85,64.14 | v15.24,34.29 13.97,35.56 U$1.AM1
  Bottom 0.305: v48.9,92.71 62.87,92.71 68.58,87 68.58,64.14 v29.85,64.14 | v15.24,34.29 v29.85,34.29
MA3_H  (via drill 0.61)
  Top 0.305: E6.23 58.42,90.17 57.79,90.81 57.79,94.61 57.15,95.25 57.15,124.46 55.88,125.73 E8.3 | v29.85,31.75 31.12,30.48 31.12,17.14 34.29,13.97 34.29,11.43 40.64,5.08 74.93,5.08 74.93,74.93 v66.68,83.19
  Bottom 0.305: v29.85,31.75 13.97,31.75 U$1.AL2 | v66.68,83.19 62.87,87 60.33,87 59.06,88.27 E6.23
MA3_L  (via drill 0.61)
  Top 0.305: v21.59,65.41 21.59,58.42 19.05,55.88 19.05,38.73 16.51,36.2 16.51,33.66 15.88,33.02 13.97,33.02 U$1.AL1
  Bottom 0.305: v21.59,65.41 67.31,65.41 67.31,80.64 64.77,83.19 61.6,83.19 56.52,88.27 E6.22
MA_ENABL  (via drill 0.61)
  Top 0.305: v15.88,109.86 13.97,111.76 U$1.BP1
  Bottom 0.305: v15.88,109.86 51.44,109.86 52.71,111.12 E7.4
MB2_H
  Top 0.305: 67.31,54.61 67.31,55.88 66.04,57.15 E4.4 65.41,57.78 64.14,57.78 E4.5 | 67.31,54.61 67.31,5.71 53.98,5.71 53.34,6.35 53.34,8.89 50.8,11.43 E1.20 | 67.31,54.61 70.49,57.78 E4.2
  Bottom 0.305: E4.2 71.76,57.78 73.03,57.78 E4.1
MB2_L
  Top 0.305: E4.12 69.22,50.16 70.49,50.16 E4.13
  Bottom 0.305: E4.9 61.6,50.16 62.87,50.16 E4.10 64.14,50.16 65.41,48.9 | 65.41,48.9 66.68,48.9 67.95,50.16 E4.12 | 55.88,17.78 57.79,19.68 E1.2 | 55.88,17.78 55.25,17.14 52.71,17.14 48.9,13.34 E1.19 | 65.41,48.9 65.41,17.78 55.88,17.78
MB3_H  (via drill 0.61)
  Top 0.305: E3.5 38.74,57.78 40.01,57.78 E3.4 | v59.69,53.98 59.69,15.24 58.42,13.97 E1.23 | v48.26,53.98 48.26,57.15 E3.1
  Bottom 0.305: E3.1 47.63,57.78 46.36,57.78 E3.2 45.09,57.78 43.82,56.52 42.55,56.52 41.28,57.78 E3.4 | v59.69,53.98 v48.26,53.98
MB3_L  (via drill 0.61)
  Top 0.305: E3.12 43.82,50.16 45.09,50.16 E3.13 45.72,49.53 v45.72,41.27 | E1.22 55.88,13.97 57.15,15.24 57.15,35.56 58.42,36.83 E2.2
  Bottom 0.305: E3.9 36.2,50.16 37.47,50.16 E3.10 38.74,51.44 40.01,52.7 41.28,52.7 42.55,51.44 E3.12 | v45.72,41.27 46.99,40.01 56.52,40.01 57.79,38.73 E2.2
MEM2  (via drill 0.61)
  Top 0.305: v15.88,113.03 13.97,114.94 U$1.BR1
  Bottom 0.305: R1.1 67.95,111.76 61.6,111.76 E7.1 60.33,112.39 59.06,113.67 17.78,113.67 17.15,113.03 v15.88,113.03
MEM_ENABL  (via drill 0.61)
  Top 0.305: v31.12,108.58 30.48,109.22 v30.48,126.36
  Bottom 0.305: v31.12,108.58 31.75,109.22 55.88,109.22 57.79,111.12 E7.2 | v30.48,126.36 13.97,126.36 13.97,125.73 U$1.BU2
MQ2_H  (via drill 0.61)
  Top 0.305: v19.05,105.41 17.15,103.5 17.15,97.79 15.24,95.89 15.24,94.61 13.97,93.34 U$1.BH1
  Bottom 0.305: v19.05,105.41 19.69,104.78 29.21,104.78 33.02,108.58 66.68,108.58 66.68,106.05 58.42,97.79 E6.2
MQ3_H  (via drill 0.61)
  Top 0.305: v32.39,74.93 30.48,76.83 30.48,102.87 28.58,104.78 v28.58,106.05
  Bottom 0.305: v32.39,74.93 55.88,74.93 58.42,77.47 E5.2 | v28.58,106.05 26.04,108.58 13.97,108.58 U$1.BN2
MQ_ENABL  (via drill 0.61)
  Top 0.305: 57.15,91.44 57.15,93.98 55.88,95.25 E6.3 | 57.15,91.44 57.15,81.28 55.88,80.01 E5.3 | v55.88,91.44 57.15,91.44 | v15.24,91.44 13.97,90.17 U$1.BF1
  Bottom 0.305: v15.24,91.44 v55.88,91.44
N$1  (via drill 0.61)
  Top 0.305: v39.37,62.23 36.83,59.69 36.83,42.55 v35.56,41.27 | v20.96,39.37 17.15,35.56 17.15,33.02 13.97,29.84 U$1.AK1
  Bottom 0.305: v39.37,62.23 40.64,63.5 69.22,63.5 69.22,87.63 63.5,93.34 62.87,93.34 60.96,95.25 E6.1 | v35.56,41.27 34.29,40.01 24.77,40.01 23.5,38.73 21.59,38.73 v20.96,39.37
N$2  (via drill 0.61)
  Top 0.305: v57.15,41.91 57.15,73.66 60.96,77.47 E5.1
  Bottom 0.305: v57.15,41.91 56.52,42.55 40.01,42.55 39.37,43.18 20.32,43.18 17.15,40.01 13.97,40.01 U$1.AN2
N$3  (via drill 0.61)
  Top 0.305: v15.24,41.91 15.24,43.81 13.97,45.09 U$1.AR1
  Bottom 0.305: v15.24,41.91 17.78,41.91 19.69,43.81 40.01,43.81 40.64,43.18 59.69,43.18 59.69,29.21 60.33,28.57 60.96,28.57 60.96,21.59 E1.1
N$4  (via drill 0.61)
  Top 0.305: v17.78,45.09 17.78,53.98 17.15,54.61 13.97,54.61 U$1.AU1
  Bottom 0.305: v17.78,45.09 28.58,45.09 29.21,45.72 60.96,45.72 60.96,39.37 E2.1
NO_SHIFT  (via drill 0.61)
  Top 0.305: 46.99,26.04 46.99,33.66 48.26,34.92 48.26,36.83 E2.6 | 46.99,26.04 46.99,22.86 45.72,21.59 E1.7 | v45.72,26.04 46.99,26.04 | v17.78,25.4 17.15,24.77 17.15,17.78 15.88,16.51 13.97,16.51 U$1.AE1
  Bottom 0.305: v45.72,26.04 18.42,26.04 v17.78,25.4
PC2_H  (via drill 0.61)
  Top 0.305: v52.07,49.53 52.71,50.16 52.71,67.94 50.8,69.85 E5.20 | v16.51,47.62 16.51,41.27 15.88,40.64 13.97,40.64 13.97,41.27 U$1.AP1 | v50.8,107.31 50.8,110.49 E7.5 | v65.41,77.47 v65.41,107.31
  Bottom 0.305: v52.07,49.53 50.17,47.62 22.86,47.62 22.23,46.99 17.15,46.99 v16.51,47.62 | v65.41,107.31 v50.8,107.31 | v65.41,77.47 62.23,74.3 53.98,74.3 51.44,71.75 E5.20
PC2_L  (via drill 0.61)
  Top 0.305: v30.48,69.22 27.31,66.04 27.31,46.99 v27.94,46.35
  Bottom 0.305: v30.48,69.22 46.36,69.22 47.63,70.48 E5.19 | v27.94,46.35 13.97,46.35 U$1.AR2
PC3_H  (via drill 0.61)
  Top 0.305: v70.49,77.47 70.49,71.12 62.87,71.12 62.23,71.75 62.23,73.03 60.33,73.03 59.06,71.75 E5.23 | v55.25,114.94 52.07,118.11 52.07,124.46 50.8,125.73 E8.5 | v16.51,38.1 13.97,38.1 U$1.AN1 | v31.12,38.1 31.12,64.77 v33.02,66.67
  Bottom 0.305: v70.49,77.47 70.49,114.94 v55.25,114.94 | v16.51,38.1 v31.12,38.1 | v33.02,66.67 33.66,67.31 55.88,67.31 58.42,69.85 E5.23
PC3_L  (via drill 0.61)
  Top 0.305: v55.88,44.45 55.88,69.85 E5.22
  Bottom 0.305: v55.88,44.45 19.05,44.45 17.78,43.18 13.97,43.18 U$1.AP2
PC_ENABL
  Top 0.305: E7.6 48.26,113.03 46.99,114.3 46.99,124.46 48.26,125.73 E8.6
  Bottom 0.305: E8.6 47.63,126.36 45.09,123.83 19.05,123.83 14.61,119.38 13.97,119.38 U$1.BS2
SC2  (via drill 0.61)
  Top 0.305: v17.15,88.27 15.24,86.36 15.24,85.09 13.97,83.82 U$1.BD1
  Bottom 0.305: v17.15,88.27 32.39,88.27 E6.13
SC3  (via drill 0.61)
  Top 0.305: v20.32,72.39 v20.32,106.05 | v15.24,107.31 13.97,108.58 U$1.BN1
  Bottom 0.305: v20.32,72.39 31.75,72.39 32.39,71.75 E5.13 | v20.32,106.05 19.05,107.31 v15.24,107.31
SC_ENABL
  Top 0.305: E5.14 35.56,72.39 34.93,73.03 34.93,76.83 34.29,77.47 34.29,86.36 35.56,87.63 E6.14
  Bottom 0.305: E6.14 34.93,89.53 33.66,90.81 20.96,90.81 19.69,89.53 13.97,89.53 U$1.BF2
SHIFT_L1
  Top 0.305: E1.10 38.1,21.59 39.37,22.86 39.37,35.56 40.64,36.83 E2.9
  Bottom 0.305: E1.10 37.47,19.68 36.2,18.41 16.51,18.41 15.88,19.05 13.97,19.05 U$1.AF2
SHIFT_L2  (via drill 0.61)
  Top 0.305: E1.14 35.56,13.97 34.29,15.24 34.29,21.59 35.56,22.86 35.56,29.21 E2.14 | v15.88,25.4 13.97,23.5 U$1.AH1
  Bottom 0.305: v15.88,25.4 17.15,26.67 31.75,26.67 34.93,29.84 E2.14
SHIFT_R1
  Top 0.305: E1.8 43.18,21.59 41.91,22.86 41.91,39.37 41.28,40.01 38.1,40.01 38.1,39.37 E2.10
  Bottom 0.305: E1.8 42.55,19.68 41.28,18.41 37.47,18.41 36.83,17.78 17.78,17.78 14.61,14.61 13.97,14.61 U$1.AD2
SHIFT_R2  (via drill 0.61)
  Top 0.305: E1.4 53.34,21.59 52.07,22.86 52.07,34.29 53.34,35.56 53.34,36.83 E2.4 | v17.78,14.61 13.97,14.61 U$1.AD1
  Bottom 0.305: v17.78,14.61 19.05,15.88 41.91,15.88 44.45,18.41 51.44,18.41 52.71,19.68 E1.4
SR2  (via drill 0.61)
  Top 0.305: v17.15,95.89 16.51,95.25 16.51,89.53 13.97,87 U$1.BE1
  Bottom 0.305: v17.15,95.89 27.94,95.89 30.48,98.42 36.2,98.42 37.47,97.16 E6.10
SR3  (via drill 0.61)
  Top 0.305: v19.05,82.55 17.78,83.82 v17.78,85.09
  Bottom 0.305: v19.05,82.55 20.32,81.28 35.56,81.28 37.47,79.38 E5.10 | v17.78,85.09 17.15,84.45 13.97,84.45 U$1.BD2
SR_ENABL  (via drill 0.61)
  Top 0.305: E5.11 35.56,80.01 36.2,80.64 36.2,87 36.83,87.63 36.83,93.98 35.56,95.25 E6.11 | v15.24,80.64 13.97,80.64 U$1.BC1
  Bottom 0.305: v15.24,80.64 33.66,80.64 34.93,79.38 E5.11
TT_SHIFT
  Top 0.305: E1.16 40.64,13.97 39.37,15.24 39.37,21.59 40.64,22.86 40.64,29.21 E2.16
  Bottom 0.305: E8.22 56.52,118.75 57.79,117.47 67.31,117.47 67.95,118.11 69.22,118.11 77.47,109.86 77.47,10.79 42.55,10.79 41.28,12.06 E1.16
VCC  (via drill 0.61)
  Top 0.305: 20.32,48.26 20.32,55.88 22.86,58.42 22.86,67.94 C3P.+ 22.86,69.22 22.86,78.74 20.96,80.64 20.96,104.78 22.23,106.05 C4P.+ | 20.32,48.26 20.32,43.18 22.23,41.27 C2P.+ 22.23,40.01 22.23,38.73 20.32,36.83 20.32,7.62 22.23,5.71 C1P.+ | C1.1 63.5,14.61 64.77,15.88 64.77,29.84 63.5,31.11 C2.1 | R1.2 78.74,112.39 78.74,116.2 R2.2 78.74,117.47 78.74,126.36 R3.2 | 62.23,86.36 62.23,74.3 63.5,73.03 C5.1 | 62.23,86.36 60.96,87.63 E6.24 | 62.23,101.6 60.96,102.87 E7.24 | 62.23,86.36 62.23,101.6 | 62.23,101.6 62.23,116.84 60.96,118.11 E8.24 | E4.14 73.66,52.07 72.39,53.34 72.39,59.69 61.6,70.48 E5.24 | 20.32,48.26 v21.59,48.26
  Bottom 0.305: C1P.+ 22.23,4.45 13.97,4.45 U$1.AA2 | U$1.BA2 13.97,73.66 17.15,73.66 21.59,69.22 22.23,69.22 C3P.+ | E1.24 61.6,13.34 62.23,13.97 62.87,13.97 C1.1 63.5,14.61 73.66,24.77 73.66,49.53 E4.14 74.3,51.44 74.93,52.07 75.57,52.07 C4.1 76.2,52.7 52.07,52.7 51.44,52.07 C3.1 50.17,52.07 49.53,52.07 48.9,51.44 E3.14 47.63,50.16 46.36,48.9 22.23,48.9 v21.59,48.26 | E2.24 61.6,31.11 62.23,31.75 62.87,31.75 C2.1 | E8.24 61.6,120.02 62.23,120.65 62.87,120.65 C8.1 64.14,120.65 74.3,120.65 78.11,116.84 R2.2 | E7.24 61.6,104.78 62.23,105.41 62.87,105.41 C7.1 | E5.24 61.6,71.75 62.23,72.39 62.87,72.39 C5.1 | E6.24 61.6,89.53 62.23,90.17 62.87,90.17 C6.1